# Altium schematic sheet DCDC.SchDoc
size A4; SheetNumber: 3; SheetTotal: 5
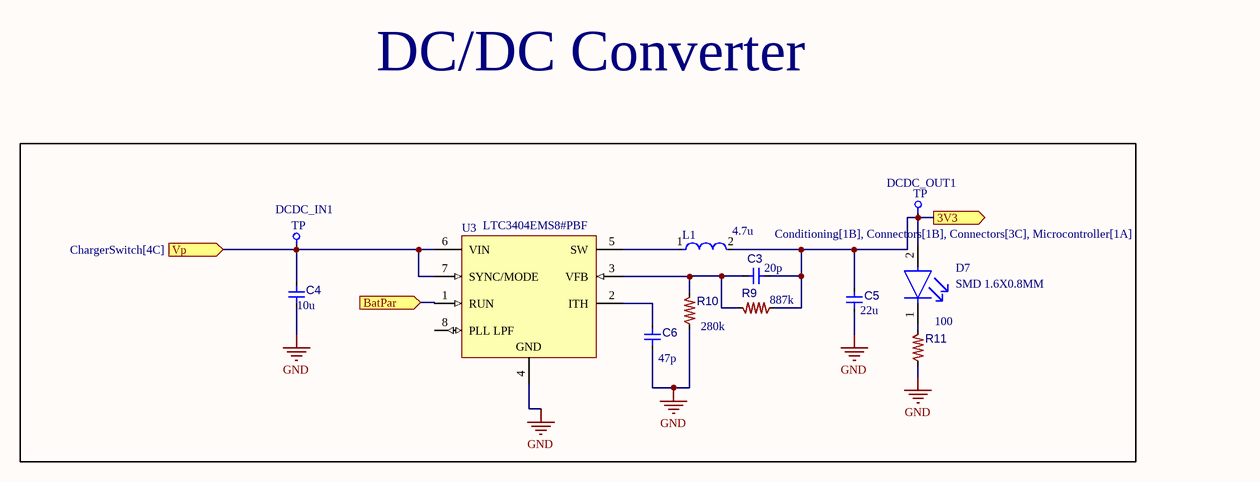
[diagram p0: DCDC.SchDoc]

## Parts
C3  C63680  [New footprint 1]  (value not drawn)
C4  C90806  [New footprint 1]  (value not drawn)
C5  C93926  [New footprint 1]  (value not drawn)
C6  C113801  [New footprint 1]  (value not drawn)
D7  SMD 1.6X0.8MM  [FP-APT1608LZGCK-MFG]
DCDC_IN1  Test Pad  [Test Pad-Footprint-1]  (value not drawn)
DCDC_OUT1  Test Pad  [Test Pad-Footprint-1]  (value not drawn)
L1  C340379  [FP-SRN4018-MFG]  (value not drawn)
R9  C403386  [0603 resistor-Footprint-1]  (value not drawn)
R10  C100930  [0603 resistor-Footprint-1]  (value not drawn)
R11  C176127  [0603 resistor-Footprint-1]  (value not drawn)
U3  LTC3404EMS8#PBF  [LT-MS8_L]

## Ports
3V3 (out, see Conditioning[1B], Connectors[1B], Connectors[3C], Microcontroller[1A]), BatPar (in, see ChargerSwitch[4D]), Vp (in, see ChargerSwitch[4C])

## Nets
GND: C4.1 C5.1 C6.1 R10.2 R11.2 U3.4(GND)
3V3: C3.2 C5.2 D7.2(A) DCDC_OUT1.1 L1.2 R9.2 ; port 3V3
BatPar: U3.1(RUN) ; port BatPar
Vp: C4.2 DCDC_IN1.1 U3.6(VIN) U3.7(SYNC/MODE) ; port Vp
NetC3_1: C3.1 R9.1 R10.1 U3.3(VFB)
NetC6_2: C6.2 U3.2(ITH)
NetD7_1: D7.1(C) R11.1
NetL1_1: L1.1 U3.5(SW)

Not connected (* = marked no-connect by the designer): U3 8(PLL_LPF)

## Notes on the sheet
- DC/DC Converter
- (near L1) 4.7u
- (near C4) 10u
- (near C3) 20p
- (near R9) 887k
- (near C5) 22u
- (near C6) 47p
- (near R10) 280k
- 100
- (in symbol CMP-00030-00001-1) TP

## Library data of the parts
C3 = CMP-001-00083-1: 200V 20pF C0G ±5% 0603 Multilayer Ceramic Capacitors MLCC - SMD/SMT ROHS
C4 = CMP-001-00083-1: 10V 10uF X5R ±10% 0603 Multilayer Ceramic Capacitors MLCC - SMD/SMT ROHS
C5 = CMP-001-00083-1: 6.3V 22uF X5R ±20% 0603 Multilayer Ceramic Capacitors MLCC - SMD/SMT ROHS
C6 = CMP-001-00083-1: 250V 47pF NP0 ±5% 0603 Multilayer Ceramic Capacitors MLCC - SMD/SMT ROHS
D7 = CMP-44529-000040-1: Standard LEDs - SMD 1.6X0.8MM LOW CRNT; Dominant Wavelength: 525nm; Forward Voltage: 2.65V; Lens Transparency: Clear; Luminous Intensity: 50mcd; Test Current: 2mA; Viewing Angle: 120°; Color: Green; Lens Color: Colorless; Width: 0.8mm; Mount: Surface Mount; Length: 1.6mm; Packaging: Cut Tape; Case Code (Metric): 1608; Height: 0.75mm; Case/Package: 0603; Case Code (Imperial): 0603
DCDC_IN1 DCDC_OUT1 = CMP-00030-00001-1
L1 = CMP-07248-000014-1: 1.9A 4.7uH ±20% 2A SMD,4x4mm  Power Inductors ROHS; Manufacturer Part Number: SRN4018-4R7M; Manufacturer: Bourns; Q Factor: 9; Series Resistance: 0.084Ω; Test Frequency: 7.96MHz; Self Resonant Frequency: 35MHz; Core Material: Ferrite; Shielding: true; Lead Free: Yes; Rms Current: 1.9A; Temperature: -40°C to +125°C; Value: 4.7uH; Inductance: 4.7uH; Device Class L1: Passive Components; Automotive: No; Octopart: https://octopart.com/srn4018-4r7m-bourns-25452396; Tolerance: 20%; Mouser Description: Fixed Inductors 4.7uH 20% SMD 4018; Package: SRN4018; Height: 1.8mm; Device Class L3: Fixed Inductors; ComponentLink2Description: Datasheet; Composition: Wirewound; Category: Ind; RoHS: TRUE; ComponentLink2URL: https://www.bourns.com/docs/Product-Datasheets/SRN4018.pdf; Temperature Range High: +125°C; Temperature Range Low: -40°C; Digikey Description: FIXED IND 4.7UH 1.9A 84 MOHM SMD; Saturation Current: 2A; Device Class L2: Inductors
R9 = CMP-009-00177-1: 100mW Thick Film Resistors ±100ppm/℃ ±1% 887000Ω 0603 Chip Resistor - Surface Mount ROHS
R10 = CMP-009-00177-1: 100mW Thick Film Resistors ±100ppm/℃ ±1% 280kΩ 0603 Chip Resistor - Surface Mount ROHS
R11 = CMP-009-00177-1: 100mW Thick Film Resistors ±100ppm/℃ ±1% 100Ω 0603 Chip Resistor - Surface Mount ROHS
U3 = CMP-0492-01333-1: Step-down type Adjustable 600mA 2.65V~6V 0.8V~6V MSOP-8  DC-DC Converters ROHS; Manufacturer: Linear Technology; Frequency Sync Range: 1MHz - 1.7MHz; Number of Outputs: 1; ComponentLink3Description: Package Specification; ComponentLink1URL: http://www.linear.com/; PackageVersion: Rev. G, 05/2013; PackageReference: MS8; ComponentLink1Description: Manufacturer URL; ComponentLink2Description: Datasheet; PackageDescription: 8-Pin Plastic MSOP, Body 3 x 3 mm, Pitch 0.65 mm; DatasheetVersion: Rev. B; RoHS: TRUE; ComponentLink2URL: http://cds.linear.com/docs/en/datasheet/3404fb.pdf; PartNumber: LTC3404EMS8#PBF; ComponentLink3URL: http://cds.linear.com/docs/en/packaging/05081660_G_MS8.pdf; Mounting Technology: Surface Mount